# Altium schematic sheet WIFI.SchDoc: Network Module
size 431 x 279 mm; DrawnBy: Bin Xiao; Organization: RYSE Inc.
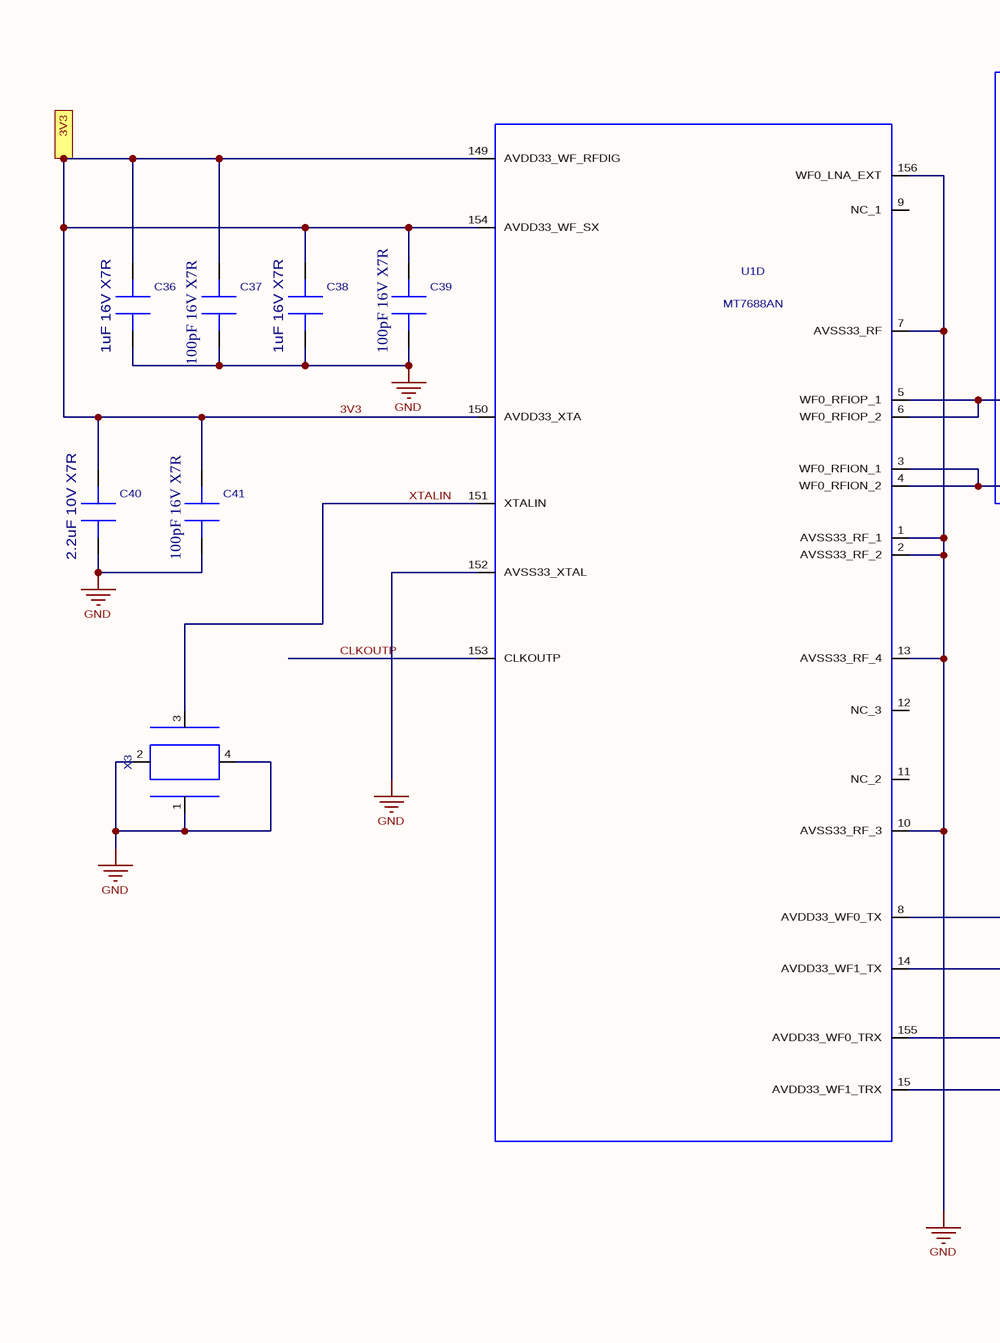
[diagram p0: WIFI.SchDoc, left]
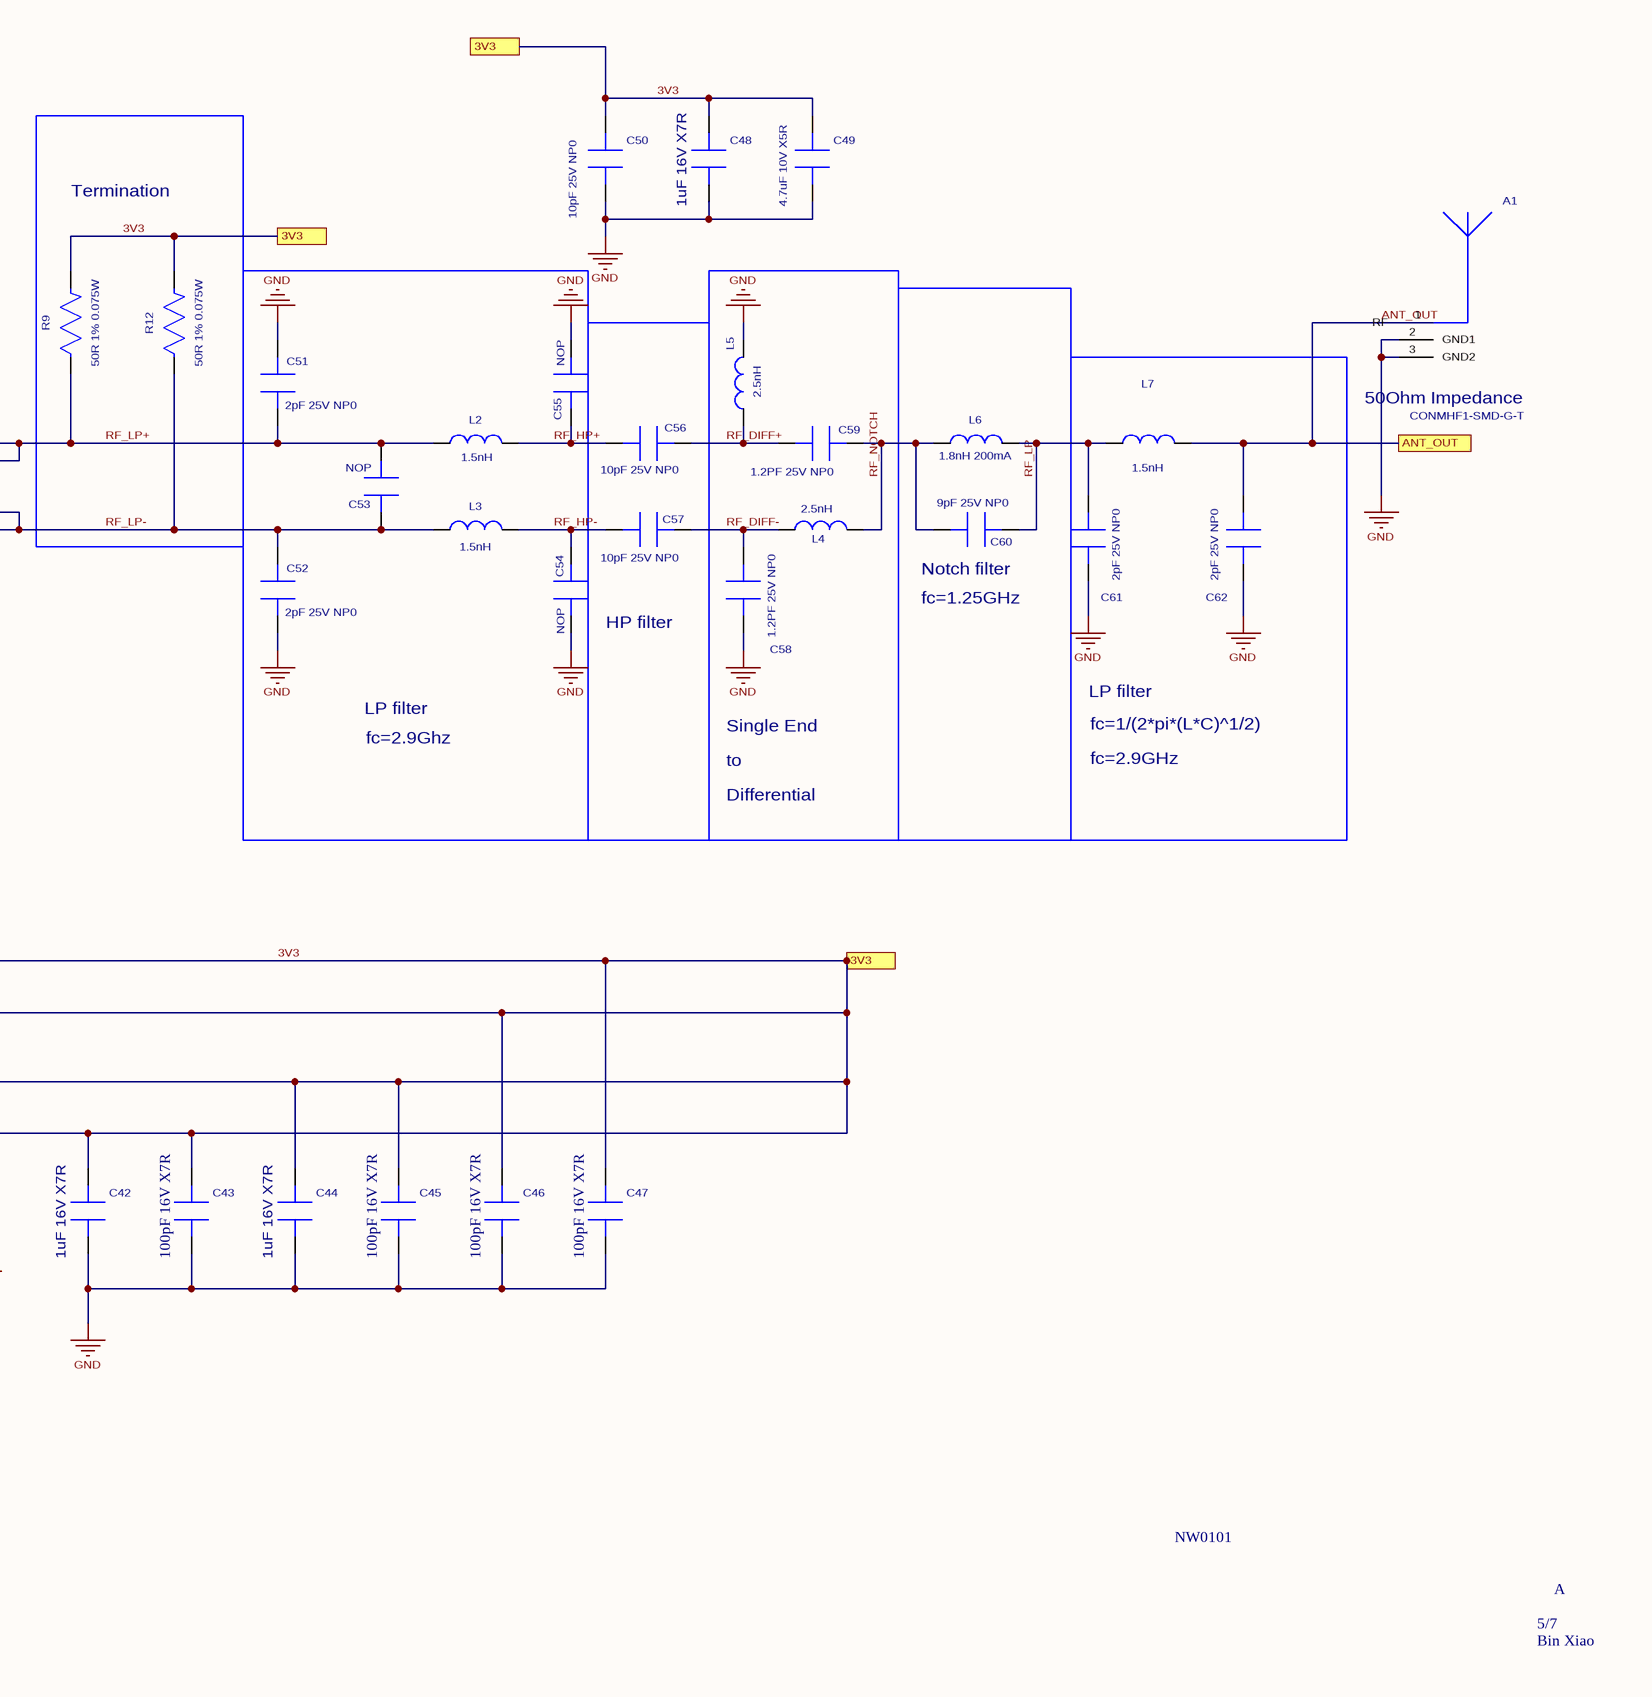
[diagram p1: WIFI.SchDoc, right]

## Parts
A1  CONMHF1-SMD-G-T  [CONMHF1-SMD-G-T]
C36  value 1uF 16V X7R  [C0402]  (hidden comment: CAP0402-105-6.3V-X7R)
C37  value 100pF 16V X7R  [C0201]  (hidden comment: CAP0201-101-16V-X7R)
C38  value 1uF 16V X7R  [C0402]  (hidden comment: CAP0402-105-6.3V-X7R)
C39  value 100pF 16V X7R  [C0201]  (hidden comment: CAP0201-101-16V-X7R)
C40  value 2.2uF 10V X7R  [C0402]  (hidden comment: CAP0402-225-6.3V-X7R)
C41  value 100pF 16V X7R  [C0201]  (hidden comment: CAP0201-101-16V-X7R)
C42  value 1uF 16V X7R  [C0402]  (hidden comment: CAP0402-105-6.3V-X7R)
C43  value 100pF 16V X7R  [C0201]  (hidden comment: CAP0201-101-16V-X7R)
C44  value 1uF 16V X7R  [C0402]  (hidden comment: CAP0402-105-6.3V-X7R)
C45  value 100pF 16V X7R  [C0201]  (hidden comment: CAP0201-101-16V-X7R)
C46  value 100pF 16V X7R  [C0201]  (hidden comment: CAP0201-101-16V-X7R)
C47  value 100pF 16V X7R  [C0201]  (hidden comment: CAP0201-101-16V-X7R)
C48  value 1uF 16V X7R  [C0402]  (hidden comment: CAP0402-105-6.3V-X7R)
C49  value 4.7uF 10V X5R  [C0402]  (hidden comment: CAP0402-475-10V-X5R)
C50  value 10pF 25V NP0  [C0201]  (hidden comment: CAP0201-100-25V-NP0)
C51  value 2pF 25V NP0  [C0201]  (hidden comment: CAP0201-020-25V-NP0)
C52  value 2pF 25V NP0  [C0201]  (hidden comment: CAP0201-020-25V-NP0)
C53  value NOP  [C0201_NOP]  (hidden comment: CAP0201-NOP)
C54  value NOP  [C0201_NOP]  (hidden comment: CAP0201-NOP)
C55  value NOP  [C0201_NOP]  (hidden comment: CAP0201-NOP)
C56  value 10pF 25V NP0  [C0201]  (hidden comment: CAP0201-100-25V-NP0)
C57  value 10pF 25V NP0  [C0201]  (hidden comment: CAP0201-100-25V-NP0)
C58  value 1.2PF 25V NP0  [C0201]  (hidden comment: CAP0201-1R2-25V-NP0)
C59  value 1.2PF 25V NP0  [C0201]  (hidden comment: CAP0201-1R2-25V-NP0)
C60  value 9pF 25V NP0  [C0201]  (hidden comment: CAP0201-090-100V-NP0)
C61  value 2pF 25V NP0  [C0201]  (hidden comment: CAP0201-020-25V-NP0)
C62  value 2pF 25V NP0  [C0201]  (hidden comment: CAP0201-020-25V-NP0)
L2  value 1.5nH  [L0201]  (hidden comment: IND0201_1.5N_600MA)
L3  value 1.5nH  [L0201]  (hidden comment: IND0201_1.5N_600MA)
L4  value 2.5nH  [L0201]  (hidden comment: IND0201_2.5N_500MA)
L5  value 2.5nH  [L0201]  (hidden comment: IND0201_2.5N_500MA)
L6  value 1.8nH 200mA  [L0201]  (hidden comment: IND0201_1.8N_200MA)
L7  value 1.5nH  [L0201]  (hidden comment: IND0201_1.5N_600MA)
R9  value 50R 1% 0.075W  [R0201]  (hidden comment: RES0201-50R0)
R12  value 50R 1% 0.075W  [R0201]  (hidden comment: RES0201-50R0)
U1  MT7688AN  [DR-QFN-128]  (part D of 6)
X3  R2520-40.000-12-F-1010-TR-NS1  [R2520-40.000-12-F-1010-TR-NS1]  (value not drawn)

## Blocks framed on the sheet
Termination: R9 R12

## Ports
3V3, ANT_OUT

## Nets
GND: A1.2(GND1) A1.3(GND2) C36.2 C37.2 C38.2 C39.2 C40.2 C41.2 C42.2 C43.2 C44.2 C45.2 C46.2 C47.2 C48.2 C49.2 C50.2 C51.1 C52.2 C54.2 C55.2 C58.2 C61.2 C62.2 L5.2 U1.1(AVSS33_RF_1) U1.2(AVSS33_RF_2) U1.7(AVSS33_RF) U1.10(AVSS33_RF_3) U1.13(AVSS33_RF_4) U1.152(AVSS33_XTAL) U1.156(WF0_LNA_EXT) X3.1 X3.2(GND1) X3.4(GND2)
3V3: C36.1 C37.1 C38.1 C39.1 C40.1 C41.1 C42.1 C43.1 C44.1 C45.1 C46.1 C47.1 C48.1 C49.1 C50.1 R9.2 R12.2 U1.8(AVDD33_WF0_TX) U1.14(AVDD33_WF1_TX) U1.15(AVDD33_WF1_TRX) U1.149(AVDD33_WF_RFDIG) U1.150(AVDD33_XTA) U1.154(AVDD33_WF_SX) U1.155(AVDD33_WF0_TRX) ; port 3V3
ANT_OUT: A1.1(RF) C62.1 L7.2 ; port ANT_OUT
CLKOUTP: U1.153(CLKOUTP)
RF_DIFF+: C56.1 C59.2 L5.1
RF_DIFF-: C57.1 C58.1 L4.1
RF_HP+: C55.1 C56.2 L2.2
RF_HP-: C54.1 C57.2 L3.2
RF_LP: C60.1 C61.1 L6.2 L7.1
RF_LP+: C51.2 C53.1 L2.1 R9.1 U1.5(WF0_RFIOP_1) U1.6(WF0_RFIOP_2)
RF_LP-: C52.1 C53.2 L3.1 R12.1 U1.3(WF0_RFION_1) U1.4(WF0_RFION_2)
RF_NOTCH: C59.1 C60.2 L4.2 L6.1
XTALIN: U1.151(XTALIN) X3.3

Not connected (* = marked no-connect by the designer): U1 9(NC_1) 11(NC_2) 12(NC_3)

## Notes on the sheet
- (near A1) 50Ohm Impedance
- (near C60) Notch filter
- (near C54) HP filter
- fc=1.25GHz
- LP filter
- fc=2.9Ghz
- Single End
- to
- fc=1/(2*pi*(L*C)^1/2)
- fc=2.9GHz
- Differential
- NW0101
- 5/7
- A
- Bin Xiao

## Library data of the parts
A1 = CONMHF1-SMD-G-T: CONN UMC JACK STR SMD; Manufacturer: Linx Technologies Inc.; Prefered Vender: Digikey; PCB DECAL: CONMHF1-SMD-G-T; Part Number: CONMHF1-SMD-G-T; Revision: A; Type: Connector
C36 C38 C42 C44 C48 = CAP0402-105-6.3V-X7R: CAP CER 1UF 6.3V X7R 0402; Part Number: GRM155R70J105KA12D; Manufacturer: Murata Electronics; Prefered Vender: Digikey; Aligni Value: 1u; Type: Capacitor; Geometry.Height: 0.33mm; PCB DECAL: RC0402; Revision: A
C37 C39 C41 C43 C45-C47 = CAP0201-101-16V-X7R: CAP CER 100PF 16V X7R 0201; Part Number: 0201B101K160CT; Manufacturer: Walsin Technology Corporation; Prefered Vender: Digikey; Aligni Value: 100p; Type: Capacitor; Geometry.Height: 0.33mm; PCB DECAL: RC0201; Revision: A
C40 = CAP0402-225-6.3V-X7R: CAP CER 2.2UF 10V X7R 0402; Part Number: GRM155Z71A225KE01D; Manufacturer: Murata Electronics; Prefered Vender: Digikey; Aligni Value: 2.2u; Type: Capacitor; Geometry.Height: 0.33mm; PCB DECAL: RC0402; Revision: A
C49 = CAP0402-475-10V-X5R: CAP CER 4.7UF 10V X5R 0402; Part Number: CL05A475MP5NRNC; Manufacturer: Samsung Electro-Mechanics; Prefered Vender: Digikey; Aligni Value: 4.7u; Type: Capacitor; Geometry.Height: 0.33mm; PCB DECAL: RC0402; Revision: A
C50 C56 C57 = CAP0201-100-25V-NP0: CAP CER 10PF 25V C0G/NP0 0201; Part Number: 0201N100J250CT; Manufacturer: Walsin Technology Corporation; Prefered Vender: Digikey; Aligni Value: 10p; Type: Capacitor; Geometry.Height: 0.33mm; PCB DECAL: RC0201; Revision: A
C51 C52 C61 C62 = CAP0201-020-25V-NP0: CAP CER 2PF 25V C0G/NP0 0201; Part Number: CL03C020BA3GNNC; Manufacturer: Samsung Electro-Mechanics; Prefered Vender: Digikey; Aligni Value: 2p; Type: Capacitor; Geometry.Height: 0.33mm; PCB DECAL: RC0201; Revision: A
C53-C55 = CAP0201-NOP: NOP; Aligni Value: 12p; Type: Capacitor; Geometry.Height: 0mm; PCB DECAL: RC0201; Prefered Vender: NOP; Revision: NOP; Part Number: NOP; Manufacturer: NOP
C58 C59 = CAP0201-1R2-25V-NP0: CAP CER 1.2PF 25V C0G/NP0 0201; Part Number: GRM0335C1E1R2WA01D; Manufacturer: Murata Electronics; Prefered Vender: Digikey; Aligni Value: 1.2P; Type: Capacitor; Geometry.Height: 0.33mm; PCB DECAL: RC0201; Revision: A
C60 = CAP0201-090-100V-NP0: CAP CER 9PF 25V C0G 0201; Part Number: CGA1A2C0G1E090D030BA; Manufacturer: TDK Corporation; Prefered Vender: Digikey; Aligni Value: 9p; Type: Capacitor; Geometry.Height: 0.33mm; PCB DECAL: RC0201; Revision: A
L2 L3 L7 = IND0201_1.5N_600MA: INDUCTOR FIXED 1.5NH 0201; Part Number: WLCM0603TGB1N5TB; Manufacturer: Walsin Technology Corporation; Prefered Vender: Digikey; Geometry.Height: 1.5mm; Aligni Value: 1.5n; PCB DECAL: RC0201; Revision: A; Type: Inductor
L4 L5 = IND0201_2.5N_500MA: FIXED IND 2.5NH 500MA 200MOHM SM; Part Number: LQP03TN2N5B02D; Manufacturer: Murata Electronics; Prefered Vender: Digikey; Geometry.Height: 1.5mm; Aligni Value: 2.5n; Type: Inductor; PCB DECAL: RC0201; Revision: A
L6 = IND0201_1.8N_200MA: FIXED IND 1.8NH 200MA 550MOHM SM; Part Number: 1-2176075-8; Manufacturer: TE Connectivity Passive Product; Prefered Vender: Digikey; Geometry.Height: 1.5mm; Aligni Value: 1.8n; Type: Inductor; PCB DECAL: RC0201; Revision: A
R9 R12 = RES0201-50R0: RES 50 OHM 0.1% 0.075W 0201; Manufacturer: Vishay Dale; Part Number: TNPW020150R0BEED; Geometry.Height: 0.5mm; Prefered Vender: Digikey; Aligni Value: 50; PCB DECAL: RC0201; Type: Resistor; Revision: A
U1 = MT7688AN: 580Mhz 32bits Networking Processor; Manufacturer: MediaTek Inc; Geometry.Height: 0mm; Type: IC; Part Number: MT7688AN; PCB DECAL: DR-QFN-128
X3 = R2520-40.000-12-F-1010-TR-NS1: CRYSTAL 40.0000MHZ 12PF SMD; Manufacturer: Raltron Electronics; Geometry.Height: 0.9mm; Aligni Value: 40Meg; Prefered Vender: Digikey; Value: 40Mhz; PCB DECAL: R2520-40.000-12-F-1010-TR-NS1; Type: Crystal; Part Number: R2520-40.000-12-F-1010-TR-NS1; Revision: A